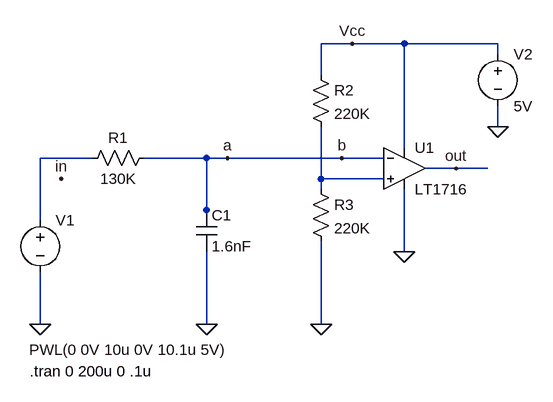
[diagram p0: schematic problem-3.asc]
problem-3.asc, the LTspice schematic file:
Version 4
SHEET 1 1128 680
WIRE 496 -288 448 -288
WIRE 576 -288 496 -288
WIRE 720 -288 576 -288
WIRE 720 -272 720 -288
WIRE 448 -240 448 -288
WIRE 720 -160 720 -192
WIRE 576 -128 576 -288
WIRE 96 -112 16 -112
WIRE 272 -112 176 -112
WIRE 304 -112 272 -112
WIRE 480 -112 304 -112
WIRE 544 -112 480 -112
WIRE 656 -96 608 -96
WIRE 704 -96 656 -96
WIRE 448 -80 448 -160
WIRE 544 -80 448 -80
WIRE 448 -64 448 -80
WIRE 272 -32 272 -112
WIRE 16 -16 16 -112
WIRE 272 -16 272 -32
WIRE 576 32 576 -64
WIRE 16 144 16 64
WIRE 272 144 272 32
WIRE 448 144 448 16
WIRE 0 0 0 0
FLAG 272 144 0
FLAG 16 144 0
FLAG 576 32 0
FLAG 448 144 0
FLAG 48 -80 in
FLAG 304 -112 a
FLAG 480 -112 b
FLAG 496 -288 Vcc
FLAG 656 -96 out
FLAG 720 -160 0
SYMBOL cap 256 -32 R0
SYMATTR InstName C1
SYMATTR Value 1.6nF
SYMBOL voltage 16 -32 R0
WINDOW 3 -17 215 Left 2
WINDOW 123 0 0 Left 0
WINDOW 39 0 0 Left 0
SYMATTR Value PWL(0 0V 10u 0V 10.1u 5V)
SYMATTR InstName V1
SYMBOL res 192 -128 R90
WINDOW 0 0 56 VBottom 2
WINDOW 3 32 56 VTop 2
SYMATTR InstName R1
SYMATTR Value 130K
SYMATTR SpiceLine tol=5
SYMBOL res 432 -80 R0
SYMATTR InstName R3
SYMATTR Value 220K
SYMBOL res 432 -256 R0
SYMATTR InstName R2
SYMATTR Value 220K
SYMBOL Comparators\\LT1716 576 -96 R0
SYMATTR InstName U1
SYMBOL voltage 720 -288 R0
WINDOW 123 0 0 Left 0
WINDOW 39 0 0 Left 0
SYMATTR InstName V2
SYMATTR Value 5V
TEXT 0 216 Left 2 !.tran 0 200u 0 .1u

The netlist it stands for:
* problem-3.asc
C1 b 0 1.6nF
V1 N001 0 PWL(0 0V 10u 0V 10.1u 5V)
R1 b N001 130K tol=5
R3 N002 0 220K
R2 Vcc N002 220K
XU1 N002 b Vcc 0 out LT1716  ; pins In+ In- V+ V- OUT
V2 Vcc 0 5V
.tran 0 200u 0 .1u
.lib LTC1.lib
.backanno
.end